# Altium schematic sheet FPGA.SchDoc
size A4
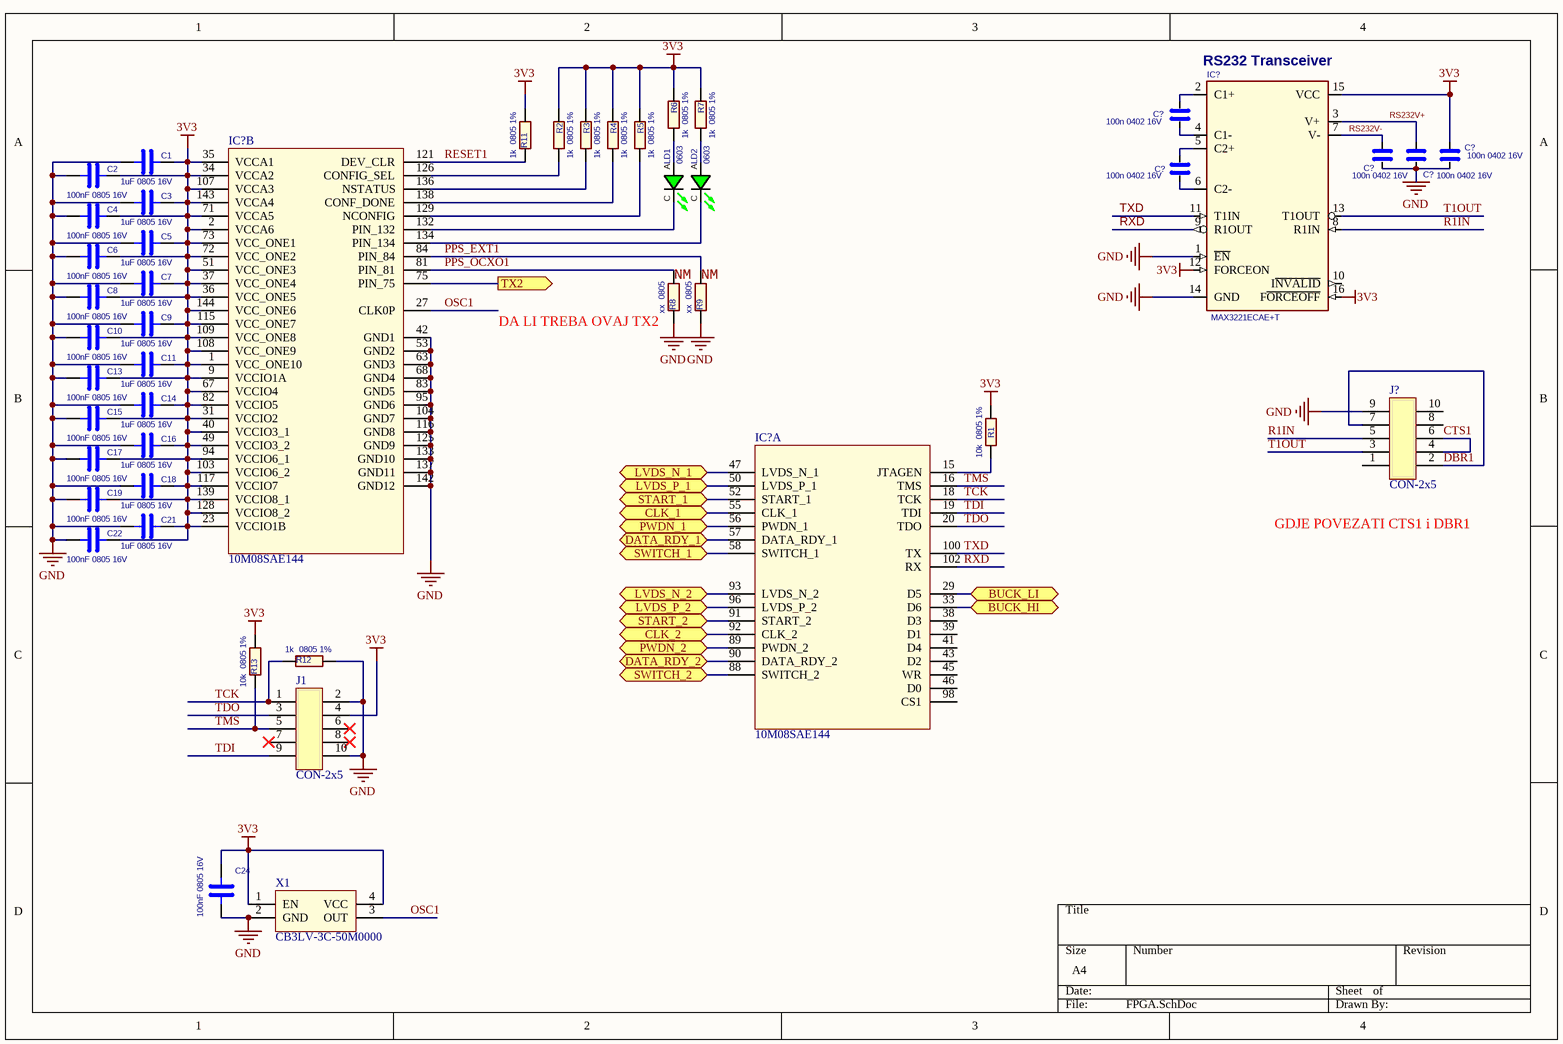
[diagram p0: FPGA.SchDoc]

## Parts
(Parts that share a designator on the sheet are numbered #1, #2 ... from top to bottom, then left to right.)
C1  1uF 0805 16V  [CAP-0805]
C2  100nF 0805 16V  [CAP-0805]
C3  1uF 0805 16V  [CAP-0805]
C4  100nF 0805 16V  [CAP-0805]
C5  1uF 0805 16V  [CAP-0805]
C6  100nF 0805 16V  [CAP-0805]
C7  1uF 0805 16V  [CAP-0805]
C8  100nF 0805 16V  [CAP-0805]
C9  1uF 0805 16V  [CAP-0805]
C10  100nF 0805 16V  [CAP-0805]
C11  1uF 0805 16V  [CAP-0805]
C13  100nF 0805 16V  [CAP-0805]
C14  1uF 0805 16V  [CAP-0805]
C15  100nF 0805 16V  [CAP-0805]
C16  1uF 0805 16V  [CAP-0805]
C17  100nF 0805 16V  [CAP-0805]
C18  1uF 0805 16V  [CAP-0805]
C19  100nF 0805 16V  [CAP-0805]
C21  1uF 0805 16V  [CAP-0805]
C22  100nF 0805 16V  [CAP-0805]
C24  100nF 0805 16V  [CAP-0805]
C?#1  100n 0402 16V  [CAP-0402]
C?#2  100n 0402 16V  [CAP-0402]
C?#3  100n 0402 16V  [CAP-0402]
C?#4  100n 0402 16V  [CAP-0402]
C?#5  100n 0402 16V  [CAP-0402]
IC?#1  RS232 Interface  [DB16_L]  (value not drawn)
IC?#2  10M08SAE144  [SQFP50P2200X2200X200-144N]  (part B of 2)
IC?#3  10M08SAE144  [SQFP50P2200X2200X200-144N]  (part A of 2)
J1  CON-2x5  [PIN-2X5-2.54-1.0]
J?  CON-2x5  [PIN-2X5-2.54-1.0]
LD1  0603  [LED 0603 Green]
LD2  0603  [LED 0603 Green]
R1  10k  0805 1%  [RES-0805]
R2  1k  0805 1%  [RES-0805]
R3  1k  0805 1%  [RES-0805]
R4  1k  0805 1%  [RES-0805]
R5  1k  0805 1%  [RES-0805]
R6  1k  0805 1%  [RES-0805]
R7  1k  0805 1%  [RES-0805]
R8  xx  0805  [RES-0805]
R9  xx  0805  [RES-0805]
R11  1k  0805 1%  [RES-0805]
R12  1k  0805 1%  [RES-0805]
R13  10k  0805 1%  [RES-0805]
X1  CB3LV-3C-50M0000  [OSC]

## Ports
BUCK_HI (bidir), BUCK_LI (bidir), CLK_1 (bidir), CLK_2 (bidir), DATA_RDY_1 (bidir), DATA_RDY_2 (bidir), LVDS_N_1 (bidir), LVDS_N_2 (bidir), LVDS_P_1 (bidir), LVDS_P_2 (bidir), PWDN_1 (bidir), PWDN_2 (bidir), START_1 (bidir), START_2 (bidir), SWITCH_1 (bidir), SWITCH_2 (bidir), TX2 (out)

## Nets
3V3: C1.1 C2.1 C3.1 C4.1 C5.1 C6.1 C7.1 C8.1 C9.1 C10.1 C11.1 C13.1 C14.1 C15.1 C16.1 C17.1 C18.1 C19.1 C21.1 C22.1 C24.1 C?#4.1 IC?#1.12(FORCEON) IC?#1.15(VCC) IC?#1.16(F~{ORCEOFF}) IC?#2.1(VCC_ONE10) IC?#2.2(VCCA6) IC?#2.9(VCCIO1A) IC?#2.23(VCCIO1B) IC?#2.31(VCCIO2) IC?#2.34(VCCA2) IC?#2.35(VCCA1) IC?#2.36(VCC_ONE5) IC?#2.37(VCC_ONE4) IC?#2.40(VCCIO3_1) IC?#2.49(VCCIO3_2) IC?#2.51(VCC_ONE3) IC?#2.67(VCCIO4) IC?#2.71(VCCA5) IC?#2.72(VCC_ONE2) IC?#2.73(VCC_ONE1) IC?#2.82(VCCIO5) IC?#2.94(VCCIO6_1) IC?#2.103(VCCIO6_2) IC?#2.107(VCCA3) IC?#2.108(VCC_ONE9) IC?#2.109(VCC_ONE8) IC?#2.115(VCC_ONE7) IC?#2.117(VCCIO7) IC?#2.128(VCCIO8_2) IC?#2.139(VCCIO8_1) IC?#2.143(VCCA4) IC?#2.144(VCC_ONE6) J1.4(VCC) R1.2 R2.1 R3.1 R4.1 R5.1 R6.1 R7.1 R11.2 R13.2 X1.1(EN) X1.4(VCC)
GND: C1.2 C2.2 C3.2 C4.2 C5.2 C6.2 C7.2 C8.2 C9.2 C10.2 C11.2 C13.2 C14.2 C15.2 C16.2 C17.2 C18.2 C19.2 C21.2 C22.2 C24.2 C?#2.2 C?#3.2 C?#4.2 IC?#1.1(~{EN}) IC?#1.14(GND) IC?#2.42(GND1) IC?#2.53(GND2) IC?#2.63(GND3) IC?#2.68(GND4) IC?#2.83(GND5) IC?#2.95(GND6) IC?#2.104(GND7) IC?#2.116(GND8) IC?#2.125(GND9) IC?#2.133(GND10) IC?#2.137(GND11) IC?#2.142(GND12) J1.2(VCC) J1.10(VCC) J?.9(VCC) R8.1 R9.1 R12.2 X1.2(GND)
BUCK_HI: IC?#3.33(D6) ; port BUCK_HI
BUCK_LI: IC?#3.29(D5) ; port BUCK_LI
CLK_1: IC?#3.55(CLK_1) ; port CLK_1
CLK_2: IC?#3.92(CLK_2) ; port CLK_2
CTS1: J?.4(VCC) J?.6(VCC)
DATA_RDY_1: IC?#3.57(DATA_RDY_1) ; port DATA_RDY_1
DATA_RDY_2: IC?#3.90(DATA_RDY_2) ; port DATA_RDY_2
DBR1: J?.2(VCC) J?.7(VCC)
LVDS_N_1: IC?#3.47(LVDS_N_1) ; port LVDS_N_1
LVDS_N_2: IC?#3.93(LVDS_N_2) ; port LVDS_N_2
LVDS_P_1: IC?#3.50(LVDS_P_1) ; port LVDS_P_1
LVDS_P_2: IC?#3.96(LVDS_P_2) ; port LVDS_P_2
OSC1: IC?#2.27(CLK0P) X1.3(OUT)
PPS_EXT1: IC?#2.84(PIN_84) R9.2
PPS_OCXO1: IC?#2.81(PIN_81) R8.2
PWDN_1: IC?#3.56(PWDN_1) ; port PWDN_1
PWDN_2: IC?#3.89(PWDN_2) ; port PWDN_2
R1IN: IC?#1.8(R1IN) J?.5(VCC)
RESET1: IC?#2.121(DEV_CLR) R11.1
RS232V+: C?#3.1 IC?#1.3(V+)
RS232V-: C?#2.1 IC?#1.7(V-)
RXD: IC?#1.9(R1OUT) IC?#3.102(RX)
START_1: IC?#3.52(START_1) ; port START_1
START_2: IC?#3.91(START_2) ; port START_2
SWITCH_1: IC?#3.58(SWITCH_1) ; port SWITCH_1
SWITCH_2: IC?#3.88(SWITCH_2) ; port SWITCH_2
T1OUT: IC?#1.13(T1OUT) J?.3(VCC)
TCK: IC?#3.18(TCK) J1.1(VCC) R12.1
TDI: IC?#3.19(TDI) J1.9(VCC)
TDO: IC?#3.20(TDO) J1.3(VCC)
TMS: IC?#3.16(TMS) J1.5(VCC) R13.1
TX2: IC?#2.75(PIN_75) ; port TX2
TXD: IC?#1.11(T1IN) IC?#3.100(TX)
NetC?#1_1: C?#1.1 IC?#1.2(C1+)
NetC?#1_2: C?#1.2 IC?#1.4(C1-)
NetC?#5_1: C?#5.1 IC?#1.5(C2+)
NetC?#5_2: C?#5.2 IC?#1.6(C2-)
NetIC?#2_126: IC?#2.126(CONFIG_SEL) R2.2
NetIC?#2_129: IC?#2.129(NCONFIG) R5.2
NetIC?#2_132: IC?#2.132(PIN_132) LD1.C(CATHODE)
NetIC?#2_134: IC?#2.134(PIN_134) LD2.C(CATHODE)
NetIC?#2_136: IC?#2.136(NSTATUS) R3.2
NetIC?#2_138: IC?#2.138(CONF_DONE) R4.2
NetIC?#3_15: IC?#3.15(JTAGEN) R1.1
NetLD1_A: LD1.A(ANODE) R6.2
NetLD2_A: LD2.A(ANODE) R7.2

Not connected (* = marked no-connect by the designer): IC?#1 10(I~{NVALID}); IC?#3 38(D3) 39(D1) 41(D4) 43(D2) 45(WR) 46(D0) 98(CS1); J1 6(VCC)* 7(VCC)* 8(VCC)*; J? 1(VCC) 8(VCC) 10(VCC)

## Notes on the sheet
- (near IC?#1) RS232 Transceiver
- (near R8) NM
- (near R9) NM
- (near R8) DA LI TREBA OVAJ TX2
- (near J?) GDJE POVEZATI CTS1 i DBR1

## Library data of the parts
C1-C11 C13-C19 C21 C22 C24 = 0805CAPxxrrrrv: CAP CER rrrrUF xV x% type 0805
C?#1-C?#5 = 0402YC104KAT2A: CAP CER 100nF 16V 10% X7R 0402; Manufacturer 1: AVX Corporation; Description 1: CAP CER 0.1UF 16V 10% X7R 0402; Category 1: Capacitors; Capacitance: 0.1µF; Description 2: AVX - 0402YC104KAT2A - CAP MLCC, 0.1uF, 16V, X7R, 10%, 0402; Description 3: Multilayer Ceramic Capacitors MLCC - SMD/SMT 16volts 0.1uF 10% X7R; Category 3: Multilayer Ceramic Capacitors MLCC - SMD/SMT; Type: Commercial Surface Mount Chip; Case Length: 1 mm; Case Width: 0.5 mm; Product Status: New at Mouser; Supplier 1: Digi-Key; Supplier Part Number 1: 478-7888-6-ND; Manufacturer Part Number 1: 0402YC104KAT2A; RoHS 1: RoHS Compliant; Packaging: Digi-Reel®; Voltage - Rated: 16V; Tolerance: ±10%; Temperature Coefficient: X7R; Mounting Type: Surface Mount, MLCC; Operating Temperature: -55°C ~ 125°C; Applications: General Purpose; Ratings: -; Package / Case: 0402 (1005 Metric); Size / Dimension: 0.039" L x 0.020" W (1.00mm x 0.50mm); Height - Seated (Max): -; Thickness (Max): 0.022" (0.55mm); Lead Spacing: -; Features: -; Lead Style: -; ComponentLink1URL: http://www.avx.com/docs/Catalogs/cx7r.pdf; ComponentLink1Description: http://www.avx.com/docs/Catalogs/cx7r.pdf; Supplier 2: Farnell; Supplier Part Number 2: 2366591; Manufacturer 2: AVX; Manufacturer Part Number 2: 0402YC104KAT2A; RoHS 2: YES; ComponentLink2URL: http://www.farnell.com/datasheets/1679506.pdf; ComponentLink2Description: http://www.farnell.com/datasheets/1679506.pdf; Supplier 3: Mouser; Supplier Part Number 3: 581-0402YC104KAT2A; Manufacturer 3: AVX; Manufacturer Part Number 3: 0402YC104KAT2A; RoHS 3: RoHS Compliant; Operating Temperature Range: - 55 C to + 125 C; Package/Case: 0402 (1005 metric); Product: General Type MLCCs; Termination Style: SMD/SMT; Voltage Rating: 16 V; Case Code - in: 0402; Case Code - mm: 1005; Product Category: SMD Microwave Thin-Film Chip Capacitors; Standard Pack Qty: 10000; Temperature Coefficient/Code: X7R; RoHS - Mouser: Y; Minimum Order Quantity: 1; Reeling: True; ComponentLink3URL: http://avx.com/docs/Catalogs/cx7r.pdf; ComponentLink3Description: http://avx.com/docs/Catalogs/cx7r.pdf
IC?#1 = MAX3221ECAE+T: RS-232 Interface IC 1uA 3-5.5V Tcvr w/AutoShutdown; Manufacturer 1: Maxim Integrated; Data Rate: 250 kbps; Function: Transceiver; Propagation Delay Time ns: 0.3 us; Supply Current: 1 mA; Number of I/Os: 4; Shutdown: Yes; Number of Drivers: 1; Operating Supply Voltage: 3 V to 5.5 V; Description 2: IC TXRX RS-232 W/SHTDWN 16SSOP; Category 2: Integrated Circuits (ICs); Number of Drivers/Receivers: 1/1; Duplex: Full; Receiver Hysteresis: 500mV; Voltage - Supply: 3 V ~ 5.5 V; Description 3: MAXIM INTEGRATED PRODUCTS - MAX3221ECAE+ - TRANSCEIVE, SHUTDOWN, 3221, SSOP16; Supply Voltage Min: 3; Supply Voltage Max: 5.5; Driver Case Style: SSOP; No. of Pins: 16; Description 4: MAXIM INTEGRATED PRODUCTS - MAX3221ECAE+ - TRANSCEIVER,SHUTDOWN, 3221, SSOP16; Betriebstemperatur, min.: 0; Betriebstemperatur, max.: 70; Allgemeine IC Nummer: 3221; Betriebstemperatur: 0°C bis +70; Leistungs-/Bustreiber/Empfänger/Sendertyp: Transmitter / Receiver; Versorgungsspannungsbereich: 3V bis 5.5; Übertragungsrate: 235; Supplier 1: Mouser; Supplier Part Number 1: 700-MAX3221ECAET; RoHS 1: RoHS Compliant; Description 1: RS-232 Interface IC 1uA 3-5.5V Tcvr w/AutoShutdown; Category 1: RS-232 Interface IC; Operating Temperature Range: 0 C to + 70 C; Package / Case: SSOP-16; Packaging: Reel; Series: MAX3221E; Mounting Style: SMD/SMT; Maximum Operating Temperature: + 70 C; Minimum Operating Temperature: 0 C; Number of Receivers: 1; RoHS - Mouser: Y; Minimum Order Quantity: 1; Reeling: True; ComponentLink1URL: http://www.mouser.com/ds/2/256/MAX3221E-MAX3243E-49648.pdf; ComponentLink1Description: http://www.mouser.com/ds/2/256/MAX3221E-MAX3243E-49648.pdf; Supplier 2: Digi-Key; Supplier Part Number 2: MAX3221ECAE+TDKR-ND; Manufacturer 2: Maxim Integrated; Manufacturer Part Number 2: MAX3221ECAE+T; RoHS 2: RoHS Compliant; Type: Transceiver; Protocol: RS232; Operating Temperature: 0°C ~ 70°C; Mounting Type: Surface Mount; Supplier Device Package: 16-SSOP; ComponentLink2URL: http://datasheets.maximintegrated.com/en/ds/MAX3221E-MAX3243E.pdf; ComponentLink2Description: http://datasheets.maximintegrated.com/en/ds/MAX3221E-MAX3243E.pdf; Supplier 3: Newark; Supplier Part Number 3: 92K6566; Manufacturer 3: MAXIM INTEGRATED PRODUCTS; Manufacturer Part Number 3: MAX3221ECAE+; RoHS 3: YES; Device Type: Transceiver; IC Interface Type: RS232; No. of Drivers: 1; Operating Temperature Min: 0; ComponentLink3URL: http://www.farnell.com/datasheets/58519.pdf; ComponentLink3Description: http://www.farnell.com/datasheets/58519.pdf; Supplier 4: Farnell; Supplier Part Number 4: 9725458; Manufacturer 4: MAXIM INTEGRATED PRODUCTS; Manufacturer Part Number 4: MAX3221ECAE+; RoHS 4: YES; Treiber, IC-Typ: Transceiver; Schnittstellentyp: RS232; Treiber, Anzahl der: 1; Spannung, Versorgung min.: 3; Spannung, Versorgung max.: 5.5; Treiber IC Bauform: SSOP; Anzahl Pins: 16; MSL: MSL 1 - Unbegrenzt; Basisnummer: 3221; Digital-IC-Bauform: SSOP; Empfänger, Anzahl der: 1; Funktions-Nr.: 3221; Gehäusetyp: SSOP; Schnittstelle: RS-232; Sendeempfängertyp: RS232; Stromversorgung: 1; Manufacturer Part Number 1: MAX3221ECAE+T
IC?#2 IC?#3 = 10M08SAE144_V2: Manufacturer Part Number: 10M08SAE144C8G; Manufacturer: Intel; Supplier 1: Digi-Key; Supplier Part Number 1: 544-3132-ND
J1 J? = CONN-2x5: Manufacturer: Harwin Inc.; Manufacturer Part Number: M20-9970546
LD1 LD2 = LED_GRN_0603: 0603 GRN LED; Manufacturer 1: Osram Opto Semiconductor; Manufacturer Part Number 1: LG Q971-KN-1; Category 1: Standard LEDs - SMD; Description 1: Standard LEDs - SMD Green, 570nm 10mcd, 20mA; Illumination Colour: Green; Forward Current: 20 mA; Forward Voltage: 2.2 V; LED Size: 1.6 mm x 0.8 mm x 0.3 mm; Luminous Intensity: 10 mcd; Viewing Angle: 160 deg; Wavelength/Colour Temperature: 570 nm; Supplier 1: Mouser; Supplier Part Number 1: 720-LGQ971-KN-1; RoHS 1: RoHS Compliant; Package/Case: 0603; Packaging: Reel; Maximum Operating Temperature: + 85 C; Minimum Operating Temperature: - 40 C; Product Category: Standard LED - Surface Mount; Standard Pack Qty: 16000; RoHS - Mouser: Y; Minimum Order Quantity: 1; Reeling: True; ComponentLink1URL: http://catalog.osram-os.com/catalogue/catalogue.do;jsessionid=B82A462BB9500FF5EC02EA555C13E990?act=downloadFile&favOid=0200000600005069000100b6; ComponentLink1Description: http://catalog.osram-os.com/catalogue/catalogue.do;jsessionid=B82A462BB9500FF5EC02EA555C13E990?act=downloadFile&favOid=0200000600005069000100b6; Color: GRN
R1 R13 = CRCW080510K0FKEA: RES 10 KOHM 1/8W 1% 0805 SMD; Manufacturer 1: Vishay Dale; Description 1: RES SMD 10K OHM 1% 1/8W 0805; Category 1: Resistors; Power (Watts): 0.125W, 1/8W; Temperature Coefficient: ±100ppm/°C; Description 2: Thick Film Resistors - SMD 1/3watt 10Kohms 1% 100ppm High Power; Category 2: Thick Film Resistors - SMD; Power Rating: 330 mW; Resistance: 10 kOhms; Voltage Rating: 150 V; Brand: Vishay / Dale; Supplier 1: Digi-Key; Supplier Part Number 1: 541-10.0KCCT-ND; Manufacturer Part Number 1: CRCW080510K0FKEA; RoHS 1: RoHS Compliant; Packaging: Cut Tape (CT); Resistance (Ohms): 10k; Tolerance: ±1%; Composition: Thick Film; Features: Automotive AEC-Q200; Operating Temperature: -55°C ~ 155°C; Package / Case: 0805 (2012 Metric); Supplier Device Package: 0805 (2012 Metric); Size / Dimension: 0.079" L x 0.049" W (2.00mm x 1.25mm); Height: 0.020" (0.50mm); ComponentLink1URL: http://www.vishay.com/docs/20035/dcrcwe3.pdf; ComponentLink1Description: http://www.vishay.com/docs/20035/dcrcwe3.pdf; Supplier 2: Mouser; Supplier Part Number 2: 71-CRCW080510K0FKEAH; Manufacturer 2: Vishay; Manufacturer Part Number 2: CRCW080510K0FKEAHP; RoHS 2: RoHS Compliant By Exemption; Diameter: -; Length: 2 mm; Operating Temperature Range: - 55 C to + 155 C; Package/Case: 0805 (2012 metric); Product: Thick Film Resistors SMD; Series: CRCW-HP e3; Termination Style: SMD/SMT; Type: Pulse Proof, High Power Thick Film Chip Resistors; Width: 1.2 mm; Case Code - in: 0805; Case Code - mm: 2012; Product Category: 0805 Thick Film Chip Resistors; Standard Pack Qty: 5000; RoHS - Mouser: E; Minimum Order Quantity: 1; Reeling: True; ComponentLink2URL: http://www.mouser.com/ds/2/427/crcwhpe3-46056.pdf; ComponentLink2Description: http://www.mouser.com/ds/2/427/crcwhpe3-46056.pdf
R2-R7 R11 R12 = CRCW08051K00FKEA: RES 1 KOHM 1/8W 1% 0805 SMD; Manufacturer 1: Vishay Dale; Description 1: RES SMD 1K OHM 1% 1/8W 0805; Category 1: Resistors; Power (Watts): 0.125W, 1/8W; Temperature Coefficient: ±100ppm/°C; Description 2: Thick Film Resistors - SMD 1/8watt 1Kohms 1% 100ppm; Category 2: Thick Film Resistors - SMD; Power Rating: 125 mW (1/8 W); Resistance: 1 kOhms; Voltage Rating: 150 V; Brand: Vishay / Dale; Supplier 1: Digi-Key; Supplier Part Number 1: 541-1.00KCCT-ND; Manufacturer Part Number 1: CRCW08051K00FKEA; RoHS 1: RoHS Compliant; Packaging: Cut Tape (CT); Resistance (Ohms): 1k; Tolerance: ±1%; Composition: Thick Film; Features: Automotive AEC-Q200; Operating Temperature: -55°C ~ 155°C; Package / Case: 0805 (2012 Metric); Supplier Device Package: 0805 (2012 Metric); Size / Dimension: 0.079" L x 0.049" W (2.00mm x 1.25mm); Height: 0.020" (0.50mm); ComponentLink1URL: http://www.vishay.com/docs/20035/dcrcwe3.pdf; ComponentLink1Description: http://www.vishay.com/docs/20035/dcrcwe3.pdf; Supplier 2: Mouser; Supplier Part Number 2: 71-CRCW0805-1.0K-E3; Manufacturer 2: Vishay; Manufacturer Part Number 2: CRCW08051K00FKEA; RoHS 2: RoHS Compliant By Exemption; Length: 2 mm; Operating Temperature Range: - 55 C to + 155 C; Package/Case: 0805 (2012 metric); Product: Thick Film Resistors SMD; Series: CRCW; Termination Style: SMD/SMT; Width: 1.25 mm; Case Code - in: 0805; Case Code - mm: 2012; Product Category: 0805 Thick Film Chip Resistors; Standard Pack Qty: 5000; RoHS - Mouser: E; Minimum Order Quantity: 1; Reeling: True; ComponentLink2URL: http://www.mouser.com/ds/2/427/dcrcwe3-109170.pdf; ComponentLink2Description: http://www.mouser.com/ds/2/427/dcrcwe3-109170.pdf
R8 R9 = CRCW0805xxxxJN Default: RES xx OHM 1/8W 5% 0805 SMD; Category 1: Resistors
X1 = CB3LV-3C-50M0000: Manufacturer: CTS-Frequency Controls; Supplier 1: Digi-Key; Supplier Part Number 1: CTX283LVCT-ND; Manufacturer Part Number: CB3LV-3C-50M0000